# EAGLE design esp12carrier (EAGLE 7.6.0)
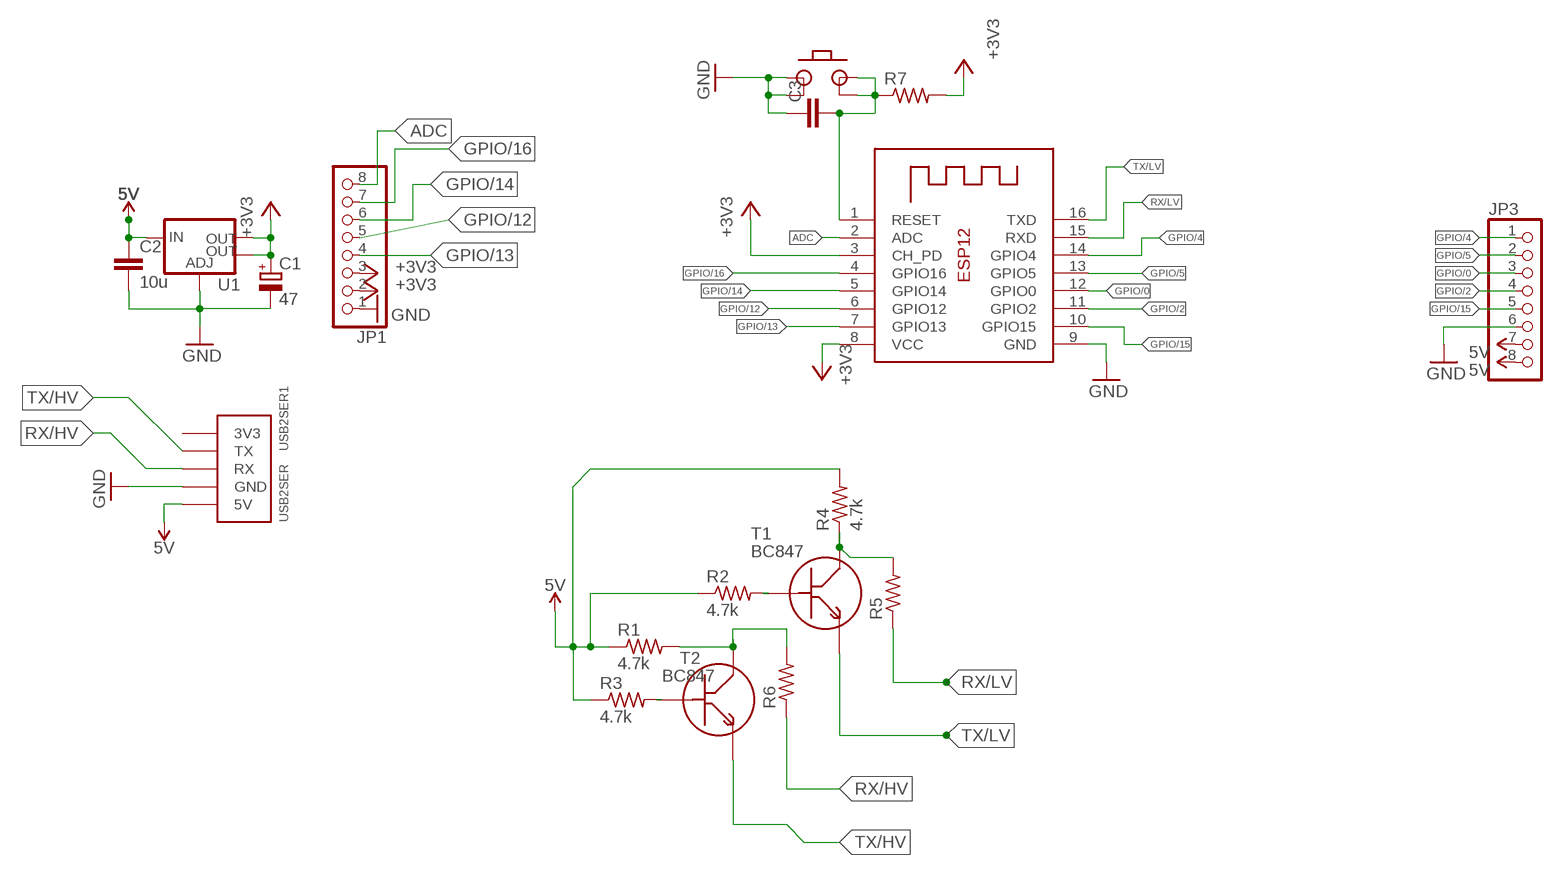
[diagram p0: schematic, sheet 1]

## Parts
C1  47  CPOL-EU150CLZ-0810  [150CLZ-0810]
C2  10u  C-EUC0805  [C0805]
C3  C-EUC0805  [C0805]
JP1  PINHD-1X8  [1X08]
JP3  PINHD-1X8  [1X08]
PB1  TACTSW  [TACTSW]
R1  4.7k  R-US_M0805  [M0805]
R2  4.7k  R-US_M0805  [M0805]
R3  4.7k  R-US_M0805  [M0805]
R4  4.7k  R-US_M0805  [M0805]
R5  R-US_M0805  [M0805]
R6  R-US_M0805  [M0805]
R7  R-US_M0805  [M0805]
T1  BC847  [BC847]
T2  BC847  [BC847]
U1  V_REG_LM1117SOT223  [SOT223]
USB2SER1  USB2SER  [USB2SER]
X2  ESP-12  [ESP-12]

## Nets
5V: C2.1 JP3.7 JP3.8 R1.1 R2.1 R3.1 R4.2 U1.3(IN) USB2SER1.P$5(5V)
+3V3: C1.+ JP1.2 JP1.3 R7.2 U1.2(OUT) U1.4(OUT) X2.3(CH_PD) X2.8(VCC)
ADC: JP1.8 X2.2(ADC)
GND: C1.- C2.2 C3.1 JP1.1 JP3.6 PB1.P$1 PB1.P$2 U1.1(ADJ) USB2SER1.P$4(GND) X2.9(GND)
GPIO/0: JP3.3 X2.12(GPIO0)
GPIO/2: JP3.4 X2.11(GPIO2)
GPIO/4: JP3.1 X2.14(GPIO4)
GPIO/5: JP3.2 X2.13(GPIO5)
GPIO/12: JP1.5 X2.6(GPIO12)
GPIO/13: JP1.4 X2.7(GPIO13)
GPIO/14: JP1.6 X2.5(GPIO14)
GPIO/15: JP3.5 X2.10(GPIO15)
GPIO/16: JP1.7 X2.4(GPIO16)
N$1: R2.2 T1.P$2(B)
N$2: R1.2 R6.2 T2.P$1(C)
N$19: R3.2 T2.P$2(B)
N$21: R4.1 R5.2 T1.P$1(C)
N$23: C3.2 PB1.P$3 PB1.P$4 R7.1 X2.1(RESET)
RX/HV: R6.1 USB2SER1.P$3(RX)
RX/LV: R5.1 X2.15(RXD)
TX/HV: T2.P$3(E) USB2SER1.P$2(TX)
TX/LV: T1.P$3(E) X2.16(TXD)

## Power pins joined to a net without a drawn wire
3V3: USB2SER1.P$1(3V3)

## Library data of the parts
C1 = resistor:CPOL-EU: POLARIZED CAPACITOR, European symbol
C2 C3 = resistor:C-EU: CAPACITOR, European symbol
JP1 JP3 = pinhead:PINHD-1X8: PIN HEADER
PB1 = TACTSW:TACTSW
R1-R7 = resistor:R-US_: RESISTOR, American symbol
T1 T2 = Arpit's Lib:BC847
U1 = SparkFun-IC-Power:V_REG_LM1117: Voltage Regulator LM1117 Standard adjustable voltage regulator but in SMD form. Spark Fun Electronics SKU : COM-00595; PROD_ID: VREG-08170
USB2SER1 = Arpit's Lib:USB2SER
X2 = adafruit:ESP-12

## Board
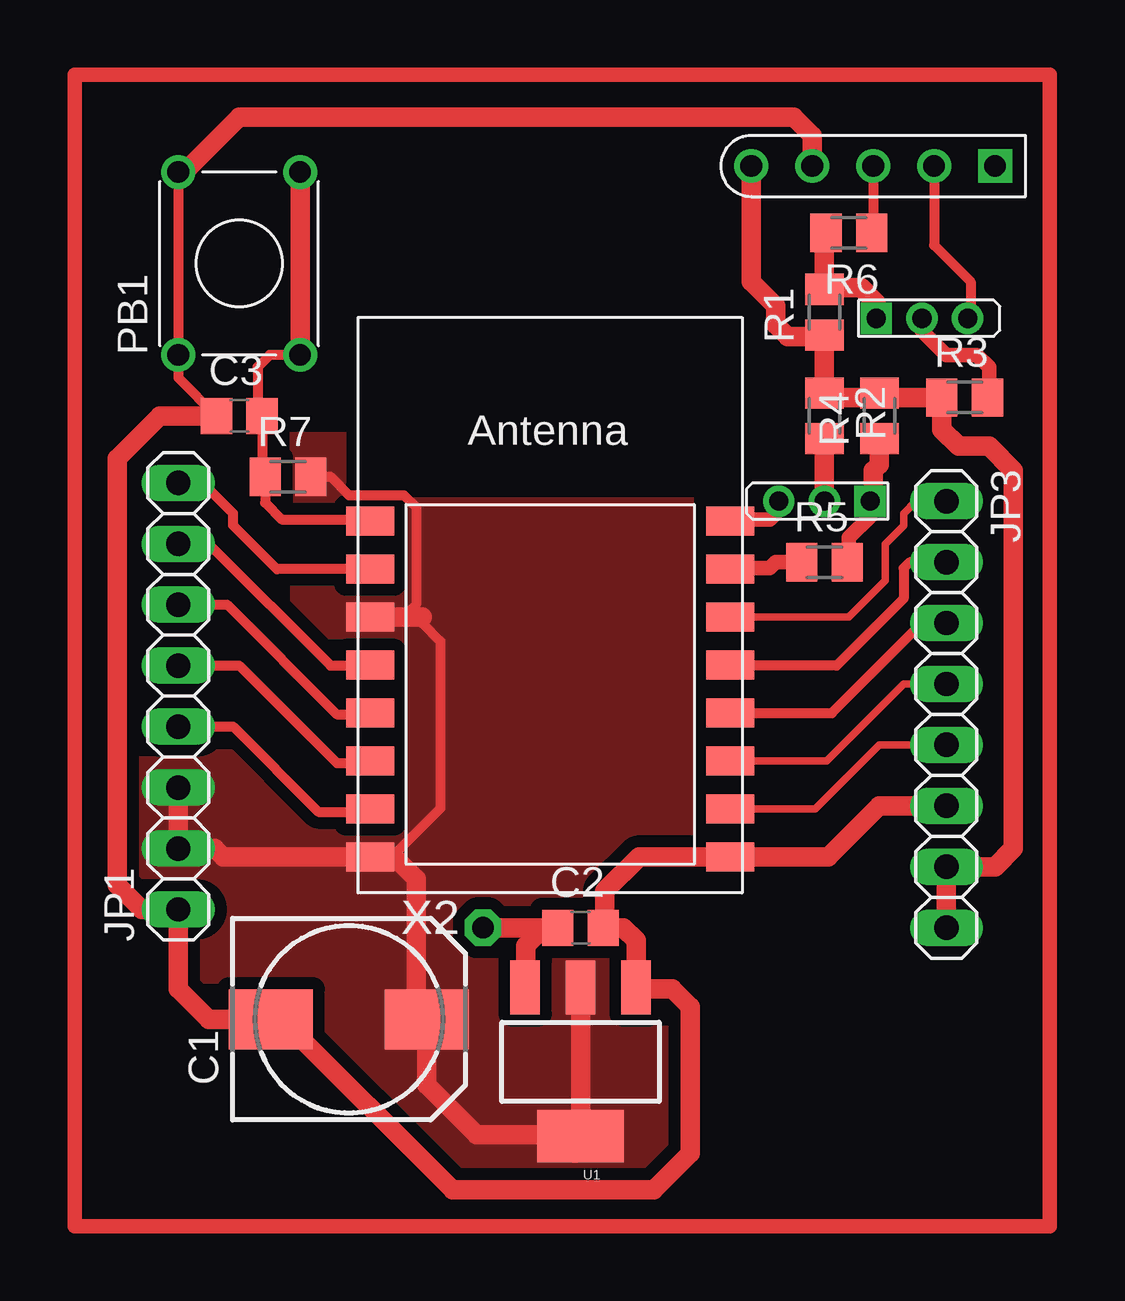
[diagram p1: board, top side]
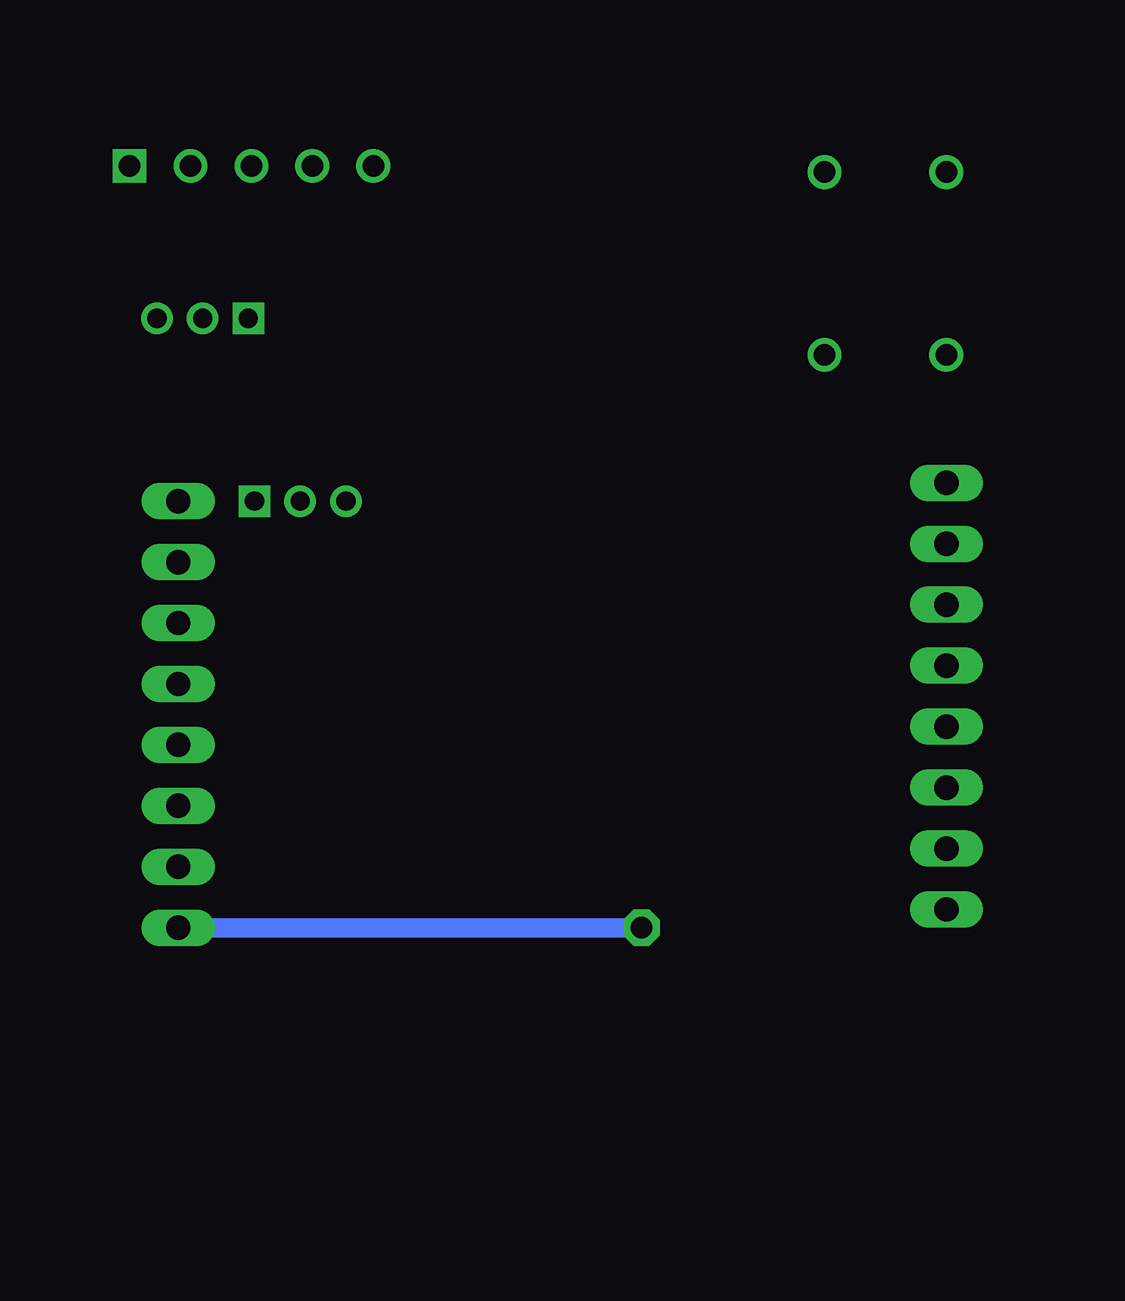
[diagram p2: board, bottom side, seen from below]

No outline drawn. Coordinates in mm, seen from the top.
Copper layers (1*16): Top 0.035mm / dielectric 1.5mm / Bottom 0.035mm
Design rules "default": minimum track width 10mil, minimum drill 24mil, track to track 8mil, track to pad 8mil, pad to pad 8mil, via to via 8mil, smd to smd 8mil, copper to edge 40mil, drill to drill 8mil, minimum pad ring 10mil, minimum via ring 8mil, stop-mask expansion 4mil, vias tented up to drill 0mil, thermal gap 10mil
tRestrict: 1 lines

### Footprints (pad centres in the part's own frame; a part is rotated, then mirrored left to right if it is on the bottom)
150CLZ-0810 = smd 3.5 x 2.5: + 3.25,0; - -3.25,0
C0805 = smd 1.3 x 1.5: 1 -0.95,0; 2 0.95,0
1X08 = drill 1.016 long: 1 -8.89,0; 2 -6.35,0; 3 -3.81,0; 4 -1.27,0; 5 1.27,0; 6 3.81,0; 7 6.35,0; 8 8.89,0
TACTSW = drill 0.9: P$1 -3.81,2.54; P$2 3.81,2.54; P$3 -3.81,-2.54; P$4 3.81,-2.54
M0805 = smd 1.3 x 1.6: 1 -0.95,0; 2 0.95,0
BC847 = drill 0.8 square: P$1 -1.905,0 | drill 0.8: P$2 0,0; P$3 1.905,0
SOT223 = smd 1.219 x 2.235: 1 -2.311,-3.099; 2 0,-3.099; 3 2.311,-3.099 | smd 3.6 x 2.2: 4 0,3.099
USB2SER = drill 0.9 square: P$1 0,0 | drill 0.9: P$2 2.54,0; P$3 5.08,0; P$4 7.62,0; P$5 10.16,0
ESP-12 = smd 2 x 1.2: 1 -7.5,4.5; 2 -7.5,2.5; 3 -7.5,0.5; 4 -7.5,-1.5; 5 -7.5,-3.5; 6 -7.5,-5.5; 7 -7.5,-7.5; 8 -7.5,-9.5; 9 7.5,-9.5; 10 7.5,-7.5; 11 7.5,-5.5; 12 7.5,-3.5; 13 7.5,-1.5; 14 7.5,0.5; 15 7.5,2.5; 16 7.5,4.5

### Placement (x,y rotation side)
C1  34.8,15.49 0 top
C2  44.45,19.3 0 top
C3  30.23,40.64 0 top
JP1  27.69,28.96 90 top
JP3  59.69,28.19 270 top
PB1  30.23,46.99 90 top
R1  54.61,44.96 90 top
R2  54.61,40.64 270 top
R3  60.45,41.4 0 top
R4  56.9,40.64 90 top
R5  54.61,34.54 0 top
R6  55.63,48.26 180 top
R7  32.26,38.1 0 top
T1  54.61,37.08 180 top
T2  58.67,44.7 0 top
U1  44.45,13.72 180 top
USB2SER1  61.72,51.05 180 top
X2  43.18,31.75 0 top

### Tracks (layer width: path | path; a pad name or v marks a point on that pad's centre or on a via)
5V  (via drill 0.9 pad 1.52)
  Top 0.406: R4.2 56.96,41.59 57.15,41.4
  Top 0.813: U1.3 42.16,16.84 42.16,18.54 42.67,19.05 43.43,19.05 43.5,19.12 C2.1 v40.39,19.3 | JP3.8 JP3.7 61.72,21.84 62.48,22.61 62.48,38.35 61.47,39.37 60.2,39.37 59.5,40.07 R3.1 57.08,41.4 R4.2 | USB2SER1.P$5 51.56,46.23 52.58,45.21 52.58,44.45 53.09,43.94 54.54,43.94 R1.1 R2.1 54.8,41.4 57.15,41.4
  Bottom 0.813: JP3.8 v40.39,19.3
+3V3
  Top 0.406: R7.2 34.04,38.1 34.8,37.34 37.08,37.34 37.59,36.83 37.59,32.77 37.08,32.26 X2.3 | 37.85,32.26 37.85,32 38.61,31.24 38.61,24.28 36.58,22.25
  Top 0.813: JP1.3 JP1.2 29.21,22.61 29.57,22.25 X2.8 36.58,22.25 36.68,22.25 37.59,21.34 37.59,15.95 C1.+ 38.05,12.75 40.13,10.67 44.4,10.67 U1.4 | X2.3 37.85,32.26 | U1.2 U1.4 | U1.4 44.45,10.16 44.2,9.91 44.2,10.36 U1.4
  pour Top (isolate 0.5, no thermals): 23.62,54.61 64.01,54.61 64.01,52.83 64.26,52.83 64.26,6.86 23.62,6.86 23.62,24.89
ADC
  Top 0.406: X2.2 31.79,34.25 29.97,36.07 29.97,36.58 28.7,37.85 JP1.8
GND
  Top 0.406: PB1.P$2 PB1.P$1 27.69,42.23 C3.1
  Top 0.813: JP3.6 56.9,24.38 54.76,22.25 X2.9 46.89,22.25 45.47,20.83 45.47,19.37 C2.2 46.23,19.3 46.76,18.77 U1.1 46.81,16.76 48.26,16.76 49.02,16 49.02,9.91 47.5,8.38 39.12,8.38 32,15.49 C1.- 28.96,15.49 27.69,16.76 JP1.1 26.16,20.07 25.15,21.08 25.15,38.86 26.92,40.64 C3.1 | PB1.P$2 27.94,50.8 30.23,53.09 53.34,53.09 54.1,52.32 USB2SER1.P$4
GPIO/0
  Top 0.406: X2.12 54.92,28.25 58.67,32 JP3.3
GPIO/2
  Top 0.305: X2.11 54.7,26.25 57.91,29.46 JP3.4
GPIO/4
  Top 0.305: X2.14 55.62,32.25 57.15,33.78 57.15,35.31 57.91,36.07 57.91,36.58 58.42,37.08 JP3.1
GPIO/5
  Top 0.406: JP3.2 58.17,34.54 57.91,34.29 57.91,33.02 55.12,30.23 50.7,30.23 X2.13
GPIO/12
  Top 0.406: JP1.5 30.23,30.23 34.29,26.16 35.59,26.16 X2.6
GPIO/13
  Top 0.406: JP1.4 29.97,27.69 33.53,24.13 35.56,24.13 X2.7
GPIO/14
  Top 0.406: JP1.6 29.72,32.77 34.29,28.19 35.62,28.19 X2.5
GPIO/15
  Top 0.305: X2.10 54.22,24.25 56.9,26.92 JP3.5
GPIO/16
  Top 0.406: JP1.7 28.96,35.31 34.04,30.23 35.66,30.23 X2.4
N$1
  Top 0.813: R2.2 T1.P$2
N$2
  Top 0.813: T2.P$1 56.77,45.34 56.13,45.97 54.68,45.97 R1.2 54.61,48.19 R6.2
N$3
  Top 0.61: 23.37,54.61 23.37,54.36 23.37,6.86 64.01,6.86 64.01,54.86 23.37,54.86 23.37,54.61
N$19
  Top 0.61: T2.P$2 58.67,44.2 59.69,43.18 60.96,43.18 61.47,42.67 61.47,41.47 R3.2
N$21
  Top 0.61: T1.P$1 56.52,36.45 55.63,35.56 55.63,34.61 R5.2
  Top 0.813: R4.1 56.9,38.61 56.64,38.35 56.64,37.21 T1.P$1
N$23
  Top 0.406: PB1.P$3 31.5,43.18 30.99,42.67 30.99,40.83 C3.2 31.18,38.23 R7.1 31.31,37.02 32,36.32 35.61,36.32 X2.1
  Top 0.813: PB1.P$3 PB1.P$4
RX/HV
  Top 0.406: USB2SER1.P$3 56.64,48.33
  Top 0.813: 56.64,48.33 R6.1
RX/LV
  Top 0.61: R5.1 52.58,34.54 52.32,34.29 50.72,34.29 X2.15
TX/HV
  Top 0.406: USB2SER1.P$2 59.18,47.75 60.71,46.23 60.71,44.83 T2.P$3
TX/LV
  Top 0.61: T1.P$3 52.7,36.7 52.32,36.32 50.75,36.32 X2.16